# Altium schematic sheet Brelok_DS(NEW).SchDoc
size A4
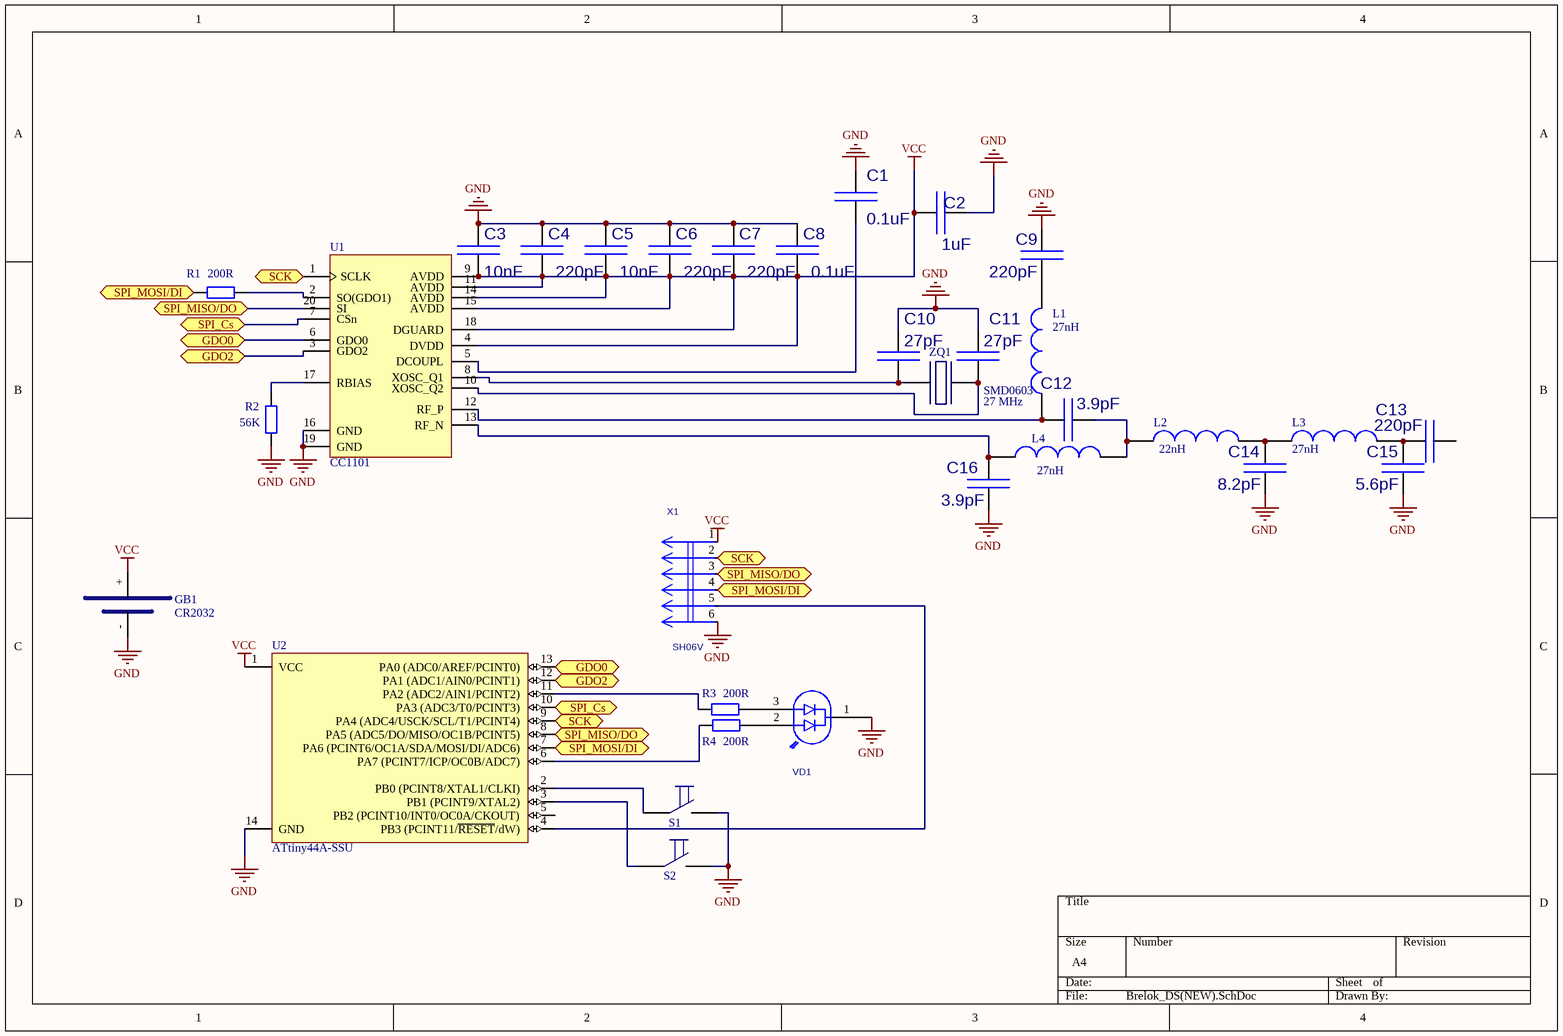
[diagram p0: Brelok_DS(NEW).SchDoc]

## Parts
C1  value 0.1uF  [C0805]  (hidden comment: KONDENS_SMD)
C2  value 1uF  [C0805]  (hidden comment: KONDENS_SMD)
C3  value 10nF  [C0805]  (hidden comment: KONDENS_SMD)
C4  value 220pF  [C0805]  (hidden comment: KONDENS_SMD)
C5  value 10nF  [C0805]  (hidden comment: KONDENS_SMD)
C6  value 220pF  [C0805]  (hidden comment: KONDENS_SMD)
C7  value 220pF  [C0805]  (hidden comment: KONDENS_SMD)
C8  value 0.1uF  [C0805]  (hidden comment: KONDENS_SMD)
C9  value 220pF  [C0805]  (hidden comment: KONDENS_SMD)
C10  value 27pF  [C0805]  (hidden comment: KONDENS_SMD)
C11  value 27pF  [C0805]  (hidden comment: KONDENS_SMD)
C12  value 3.9pF  [C0805]  (hidden comment: KONDENS_SMD)
C13  value 220pF  [C0805]  (hidden comment: KONDENS_SMD)
C14  value 8.2pF  [C0805]  (hidden comment: KONDENS_SMD)
C15  value 5.6pF  [C0805]  (hidden comment: KONDENS_SMD)
C16  value 3.9pF  [C0805]  (hidden comment: KONDENS_SMD)
GB1  CR2032  [BAT_Holder_CR2032]
L1  value 27nH  [6-0805_M]  (hidden comment: SMD_0805)
L2  value 22nH  [6-0805_M]  (hidden comment: SMD_0805)
L3  value 27nH  [6-0805_M]  (hidden comment: SMD_0805)
L4  value 27nH  [6-0805_M]  (hidden comment: SMD_0805)
R1  value 200R  [C0805]  (hidden comment: RES)
R2  value 56K  [C0805]  (hidden comment: RES)
R3  value 200R  [C0805]  (hidden comment: RES)
R4  value 200R  [C0805]  (hidden comment: RES)
S1  KAN0642-0501B  [KAN0642-0501B]  (value not drawn)
S2  KAN0642-0501B  [KAN0642-0501B]  (value not drawn)
U1  CC1101  [VQFN20]
U2  ATtiny44A-SSU  [14S1_N]
VD1  LIGHTDIODE2  [LIGHTDIODE2]  (value not drawn)
X1  SH06V  [SH06V]
ZQ1  SMD0603  value 27 MHz  [Quartz_SMD0603]

## Ports
GDO0, GDO2, SCK, SPI_Cs, SPI_MISO/DO, SPI_MOSI/DI

## Nets
GND: C1.1(A) C2.2(B) C3.1(A) C4.1(A) C5.1(A) C6.1(A) C7.1(A) C8.1(A) C9.1(A) C10.1(A) C11.1(A) C14.2(B) C15.2(B) C16.2(B) GB1.- R2.1 S1.2 S2.2 U1.16(GND) U1.19(GND) U2.14(GND) VD1.1 X1.6
VCC: C2.1(A) C3.2(B) C4.2(B) C5.2(B) C6.2(B) C7.2(B) C8.2(B) GB1.+ U1.4(DVDD) U1.9(AVDD) U1.11(AVDD) U1.14(AVDD) U1.15(AVDD) U1.18(DGUARD) U2.1(VCC) X1.1
GDO0: U1.6(GDO0) U2.13(PA0_(ADC0/AREF/PCINT0)) ; port GDO0
GDO2: U1.3(GDO2) U2.12(PA1_(ADC1/AIN0/PCINT1)) ; port GDO2
SCK: U1.1(SCLK) U2.9(PA4_(ADC4/USCK/SCL/T1/PCINT4)) X1.2 ; port SCK
SPI_Cs: U1.7(CSn) U2.10(PA3_(ADC3/T0/PCINT3)) ; port SPI_Cs
SPI_MISO/DO: U1.20(SI) U2.8(PA5_(ADC5/DO/MISO/OC1B/PCINT5)) X1.3 ; port SPI_MISO/DO
SPI_MOSI/DI: R1.1 U2.7(PA6_(PCINT6/OC1A/SDA/MOSI/DI/ADC6)) X1.4 ; port SPI_MOSI/DI
NetC1_2: C1.2(B) U1.5(DCOUPL)
NetC9_2: C9.2(B) L1.2
NetC10_2: C10.2(B) U1.8(XOSC_Q1) ZQ1.3
NetC11_2: C11.2(B) U1.10(XOSC_Q2) ZQ1.1
NetC12_1: C12.1(A) L1.1 U1.12(RF_P)
NetC12_2: C12.2(B) L2.1 L4.2
NetC13_1: C13.1(A) C15.1(A) L3.2
NetC14_1: C14.1(A) L2.2 L3.1
NetC16_1: C16.1(A) L4.1 U1.13(RF_N)
NetR1_2: R1.2 U1.2(SO(GDO1))
NetR2_2: R2.2 U1.17(RBIAS)
NetR3_1: R3.1 VD1.3
NetR3_2: R3.2 U2.11(PA2_(ADC2/AIN1/PCINT2))
NetR4_1: R4.1 VD1.2
NetR4_2: R4.2 U2.6(PA7_(PCINT7/ICP/OC0B/ADC7))
NetS1_1: S1.1 U2.2(PB0_(PCINT8/XTAL1/CLKI))
NetS2_1: S2.1 U2.3(PB1_(PCINT9/XTAL2))
NetU2_4: U2.4(PB3_(PCINT11/~{RESET}/dW)) X1.5

Not connected (* = marked no-connect by the designer): C13 2(B); U2 5(PB2_(PCINT10/INT0/OC0A/CKOUT)); X1 7(GND) 8(GND)

## Library data of the parts
GB1 = BAT_Holder_CR2032: BTH-W39-20
L1-L4 = Induktor_0805
R1-R4 = RES: Resistor
U2 = ATtiny44A-SSU: 8-bit AVR Microcontroller, 1.8-5.5V, 4KB Flash, 256 Bytes EEPROM, 256 Bytes SRAM, 14-pin SOIC, Industrial Grade (-40°C to 85°C), Pb-Free; Published: 1-Apr-2010; DatasheetVersion: revA, Dec-2008; PackageVersion: revA, Feb-2002; PackageReference: 14S1; Publisher: Altium Limited; PackageDescription: 14-Lead, 0.150” Wide Body, Plastic Gull Wing Small Outline Package (SOIC); Supplier 1: Digi-Key; Supplier Part Number 1: ATTINY44A-SSU-ND; Supplier 2: Farnell; Supplier Part Number 2: 1699397; Supplier 3: Mouser; Supplier Part Number 3: 556-ATTINY44A-SSU; Code_JEDEC: MS-012-AB; Code_IPC: SOIC127P600-14; ComponentLink1Description: Manufacturer Link; ComponentLink1URL: http://www.atmel.com/products/avr/default.asp?; ComponentLink2Description: ATtiny24A/44A Datasheet; ComponentLink2URL: http://www.atmel.com/dyn/resources/prod_documents/doc8183.pdf; ComponentLink3Description: ATtiny24A/44A Summary; ComponentLink3URL: http://www.atmel.com/dyn/resources/prod_documents/8183S.pdf; ComponentLink4Description: Atmel.com Home; ComponentLink4URL: http://www.atmel.com
ZQ1 = Quartz_SMD0603
VD1 = LIGHTDIODE2: Value: *
X1 = SH06V: Value: *